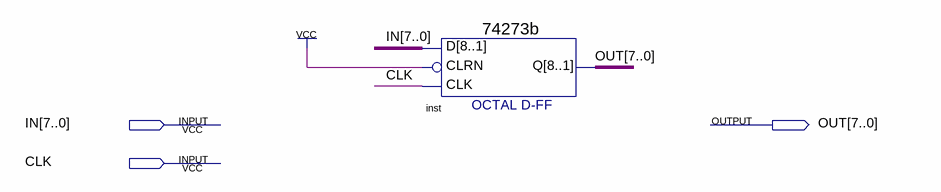
[diagram p0: schematic sheet]
// Quartus schematic Latch_Register_8bit.bdf as structural Verilog: 1 symbols, 3 pins
module Latch_Register_8bit (
  input  [7:0] IN,
  input  CLK,
  output [7:0] OUT
);

  \74273b  inst (.CLK(CLK), .D(IN), .CLRN(1'b1), .Q(OUT));
endmodule
